# EAGLE design encoder-breakout (EAGLE 6.4)
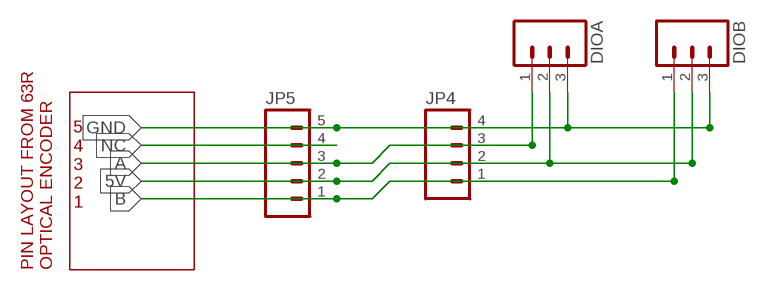
[diagram p0: schematic, sheet 1]

## Parts
DIOA  M03LOCK  [1X03_LOCK]
DIOB  M03LOCK  [1X03_LOCK]
JP4  M04LOCK  [1X04_LOCK]
JP5  M05LOCK  [1X05_LOCK]

## Nets
5V: DIOA.2 DIOB.2 JP4.2 JP5.2
A: DIOA.1 JP4.3 JP5.3
B: DIOB.1 JP4.1 JP5.1
GND: DIOA.3 DIOB.3 JP4.4 JP5.5
NC: JP5.4

## Notes on the sheet
- 5
  4
  3
  2
  1
- PIN LAYOUT FROM 63R 
  OPTICAL ENCODER

## Library data of the parts
DIOA DIOB = SparkFun-Connectors:M03: Header 3 Standard 3-pin 0.1" header. Use with straight break away headers (SKU : PRT-00116), right angle break away headers (PRT-00553), swiss pins (PRT-00743), machine pins (PRT-00117), and female headers (PRT-00115). Molex polarized connector foot print use with SKU : PRT-08232 with associated crimp pins and housings.
JP4 = SparkFun-Connectors:M04: Header 4 Standard 4-pin 0.1" header. Use with straight break away headers (SKU : PRT-00116), right angle break away headers (PRT-00553), swiss pins (PRT-00743), machine pins (PRT-00117), and female headers (PRT-00115). Molex polarized connector foot print use with SKU : PRT-08231 with associated crimp pins and housings. 1MM SMD Version SKU: PRT-10208
JP5 = SparkFun-Connectors:M05: Header 5 Standard 5-pin 0.1" header. Use with straight break away headers (SKU : PRT-00116), right angle break away headers (PRT-00553), swiss pins (PRT-00743), machine pins (PRT-00117), and female headers (PRT-00115). Molex polarized connector foot print use with SKU : PRT-08230 with associated crimp pins and housings.

## Board
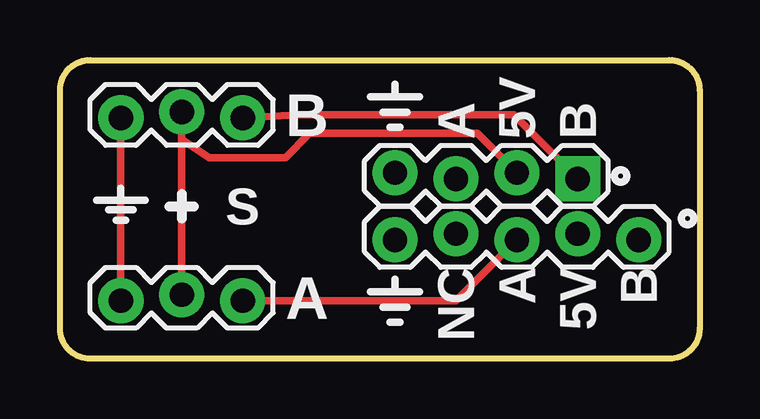
[diagram p1: board, top side]
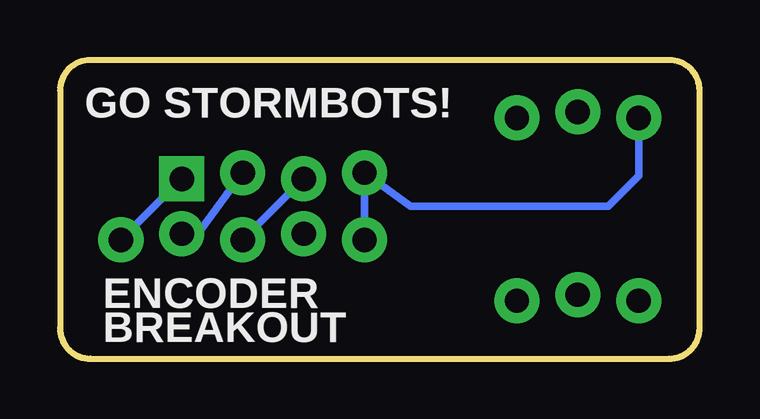
[diagram p2: board, bottom side, seen from below]

Size 26.67 x 12.45 mm. Coordinates in mm from the lower left corner, seen from the top.
Outline: 1.27,12.45 25.4,12.45 arc-90 26.67,11.18 26.67,1.27 arc-90 25.4,0 1.27,0 arc-90 0,1.27 0,11.18 arc-90 1.27,12.45
Copper layers (1*16): Top 0.035mm / dielectric 1.5mm / Bottom 0.035mm
Design rules "default": minimum track width 10mil, minimum drill 0.6mm, track to track 8mil, track to pad 8mil, pad to pad 8mil, via to via 8mil, smd to smd 8mil, copper to edge 40mil, drill to drill 8mil, minimum pad ring 10mil, minimum via ring 8mil, stop-mask expansion 4mil, vias tented up to drill 0mil, thermal gap 10mil

### Footprints (pad centres in the part's own frame; a part is rotated, then mirrored left to right if it is on the bottom)
1X03_LOCK = drill 1.016 pad 1.88: 1 0,0.127; 2 2.54,-0.127; 3 5.08,0.127
1X04_LOCK = drill 1.016 pad 1.88 square: 1 0,0.127 | drill 1.016 pad 1.88: 2 2.54,-0.127; 3 5.08,0.127; 4 7.62,-0.127
1X05_LOCK = drill 1.016 pad 1.88: 1 0,0.127; 2 2.54,-0.127; 3 5.08,0.127; 4 7.62,-0.127; 5 10.16,0.127

### Placement (x,y rotation side)
DIOA  7.62,2.54 180 top
DIOB  7.62,10.16 180 top
JP4  21.59,7.62 180 top
JP5  24.13,5.08 180 top

### Tracks (layer width: path | path; a pad name or v marks a point on that pad's centre or on a via)
5V
  Top 0.305: JP4.2 17.4,9.4 10.41,9.4 9.4,8.38 6.22,8.38 5.08,9.14 DIOB.2 DIOA.2
  Bottom 0.305: JP5.2 20.83,5.33 JP4.2
A
  Top 0.305: DIOA.1 16.51,2.41 JP5.3
  Bottom 0.305: JP5.3 JP4.3
B
  Top 0.305: JP4.1 18.92,10.16 10.03,10.16 DIOB.1
  Bottom 0.305: JP5.1 JP4.1
GND
  Top 0.305: DIOA.3 DIOB.3
  Bottom 0.305: JP5.5 JP4.4 12.06,6.35 3.81,6.35 2.54,7.62 DIOB.3

### Text on the board
tPlace: B | A | 5V | B | S | NC | A | 5V | B | A
bPlace: GO STORMBOTS! | ENCODER / BREAKOUT